# EAGLE schematic nanoTouch (EAGLE 6.5.0)
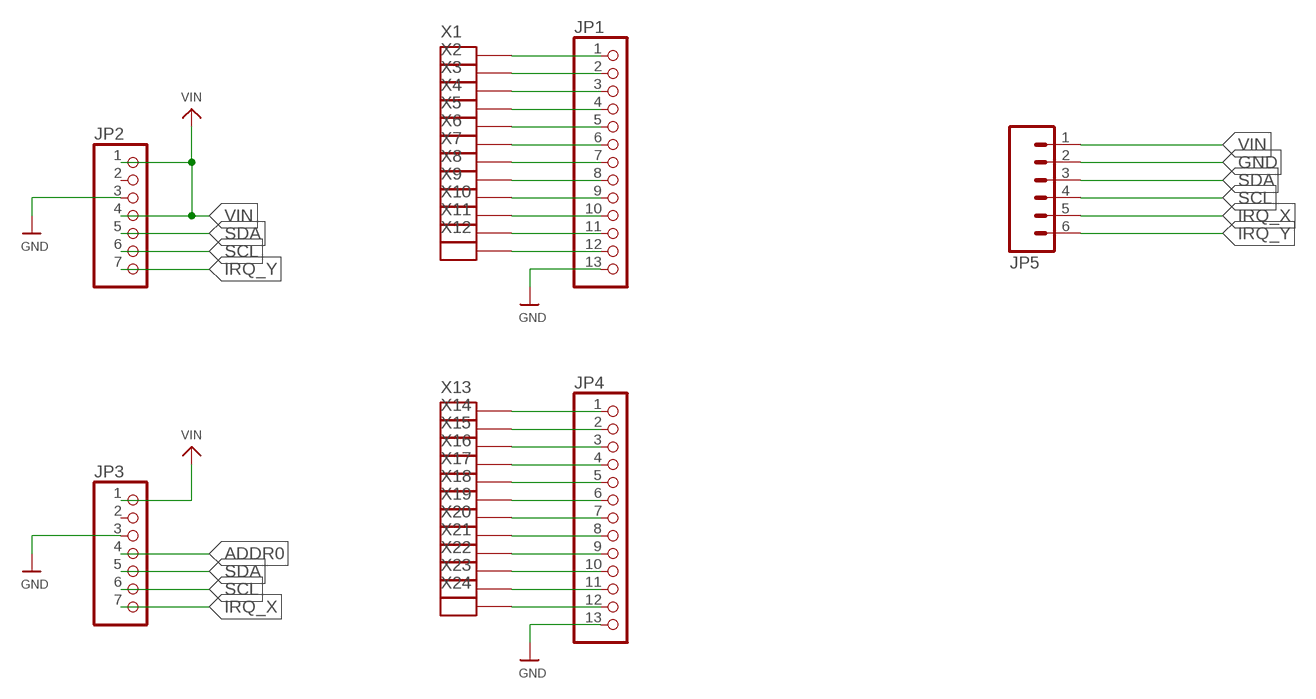
[diagram p0: schematic, sheet 1]

## Parts
JP1  HEADER-1X13  [1X13_ROUND_70]
JP2  HEADER-1X770MIL  [1X07_ROUND_70]
JP3  HEADER-1X770MIL  [1X07_ROUND_70]
JP4  HEADER-1X13  [1X13_ROUND_70]
JP5  M06SILK_FEMALE_PTH  [1X06]
X1  PAD-2X2  [PAD2X2]
X2  PAD-2X2  [PAD2X2]
X3  PAD-2X2  [PAD2X2]
X4  PAD-2X2  [PAD2X2]
X5  PAD-2X2  [PAD2X2]
X6  PAD-2X2  [PAD2X2]
X7  PAD-2X2  [PAD2X2]
X8  PAD-2X2  [PAD2X2]
X9  PAD-2X2  [PAD2X2]
X10  PAD-2X2  [PAD2X2]
X11  PAD-2X2  [PAD2X2]
X12  PAD-2X2  [PAD2X2]
X13  PAD-2X2  [PAD2X2]
X14  PAD-2X2  [PAD2X2]
X15  PAD-2X2  [PAD2X2]
X16  PAD-2X2  [PAD2X2]
X17  PAD-2X2  [PAD2X2]
X18  PAD-2X2  [PAD2X2]
X19  PAD-2X2  [PAD2X2]
X20  PAD-2X2  [PAD2X2]
X21  PAD-2X2  [PAD2X2]
X22  PAD-2X2  [PAD2X2]
X23  PAD-2X2  [PAD2X2]
X24  PAD-2X2  [PAD2X2]

## Nets
ADDR0: JP3.4
GND: JP1.13 JP2.3 JP3.3 JP4.13 JP5.2
IRQ_X: JP3.7 JP5.5
IRQ_Y: JP2.7 JP5.6
N$1: JP1.1 X1.P$1
N$2: JP1.2 X2.P$1
N$3: JP1.3 X3.P$1
N$4: JP1.4 X4.P$1
N$5: JP1.5 X5.P$1
N$6: JP1.6 X6.P$1
N$7: JP1.7 X7.P$1
N$8: JP1.8 X8.P$1
N$9: JP1.9 X9.P$1
N$10: JP1.10 X10.P$1
N$11: JP1.11 X11.P$1
N$12: JP1.12 X12.P$1
N$13: JP4.1 X13.P$1
N$14: JP4.2 X14.P$1
N$15: JP4.3 X15.P$1
N$16: JP4.4 X16.P$1
N$17: JP4.5 X17.P$1
N$18: JP4.6 X18.P$1
N$19: JP4.7 X19.P$1
N$20: JP4.8 X20.P$1
N$21: JP4.9 X21.P$1
N$22: JP4.10 X22.P$1
N$23: JP4.11 X23.P$1
N$24: JP4.12 X24.P$1
SCL: JP2.6 JP3.6 JP5.4
SDA: JP2.5 JP3.5 JP5.3
VIN: JP2.1 JP2.4 JP3.1 JP5.1
Unconnected: JP2.2 JP3.2

## Library data of the parts
JP1 JP4 = microbuilder:HEADER-1X13
JP2 JP3 = microbuilder:HEADER-1X7: PIN HEADER
JP5 = berry:M06: Header 6 Standard 6-pin 0.1" header. Use with straight break away headers (SKU : PRT-00116), right angle break away headers (PRT-00553), swiss pins (PRT-00743), machine pins (PRT-00117), and female headers (PRT-00115). Molex polarized connector foot print use with SKU : PRT-08094 with associated crimp pins and housings. NOTES ON THE VARIANTS LOCK and LOCK_LONGPADS... This footprint was designed to help hold the alignment of a through-hole component (i.e. 6-pin header) while soldering it into place. You may notice that each hole has been shifted either up or down by 0.005 of an inch from it's more standard position (which is a perfectly straight line). This slight alteration caused the pins (the squares in the middle) to touch the edges of the holes. Because they are alternating, it causes a "brace" to hold the component in place. 0.005 has proven to be the perfect amount of "off-center" position when using our standard breakaway headers. Although looks a little odd when you look at the bare footprint, once you have a header in there, the alteration is very hard to notice. Also,if you push a header all the way into place, it is covered up entirely on the bottom side. This idea of altering the position of holes to aid alignment will be further integrated into the Sparkfun Library for other footprints. It can help hold any component with 3 or more connection pins.; PROD_ID: CONN-08437
X1-X24 = nanoTouch:PAD